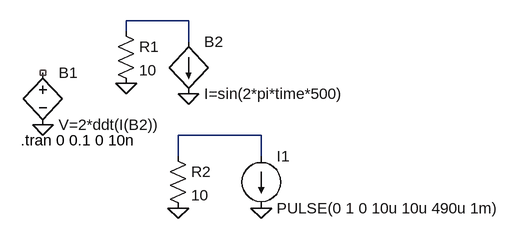
[diagram p0: schematic Draft1.asc]
Draft1.asc, the LTspice schematic file:
Version 4
SHEET 1 880 680
WIRE 240 16 144 16
WIRE 144 32 144 16
WIRE 240 48 240 16
WIRE 352 192 224 192
WIRE 224 224 224 192
WIRE 352 224 352 192
FLAG 240 128 0
FLAG 144 112 0
FLAG 16 176 0
FLAG 352 304 0
FLAG 224 304 0
SYMBOL bv 16 80 R0
SYMATTR InstName B1
SYMATTR Value V=2*ddt(I(B2))
SYMBOL bi 240 48 R0
SYMATTR InstName B2
SYMATTR Value I=sin(2*pi*time*500)
SYMBOL res 128 16 R0
SYMATTR InstName R1
SYMATTR Value 10
SYMBOL current 352 224 R0
WINDOW 123 0 0 Left 2
WINDOW 39 0 0 Left 2
SYMATTR InstName I1
SYMATTR Value PULSE(0 1 0 10u 10u 490u 1m)
SYMBOL res 208 208 R0
SYMATTR InstName R2
SYMATTR Value 10
TEXT -18 200 Left 2 !.tran 0 0.1 0 10n

The netlist it stands for:
* Draft1.asc
B1 NC_01 0 V=2*ddt(I(B2))
B2 N001 0 I=sin(2*pi*time*500)
R1 N001 0 10
I1 N002 0 PULSE(0 1 0 10u 10u 490u 1m)
R2 N002 0 10
.tran 0 0.1 0 10n
.backanno
.end